# EAGLE design ROM24k_final_rev01 (EAGLE 9.6.2)
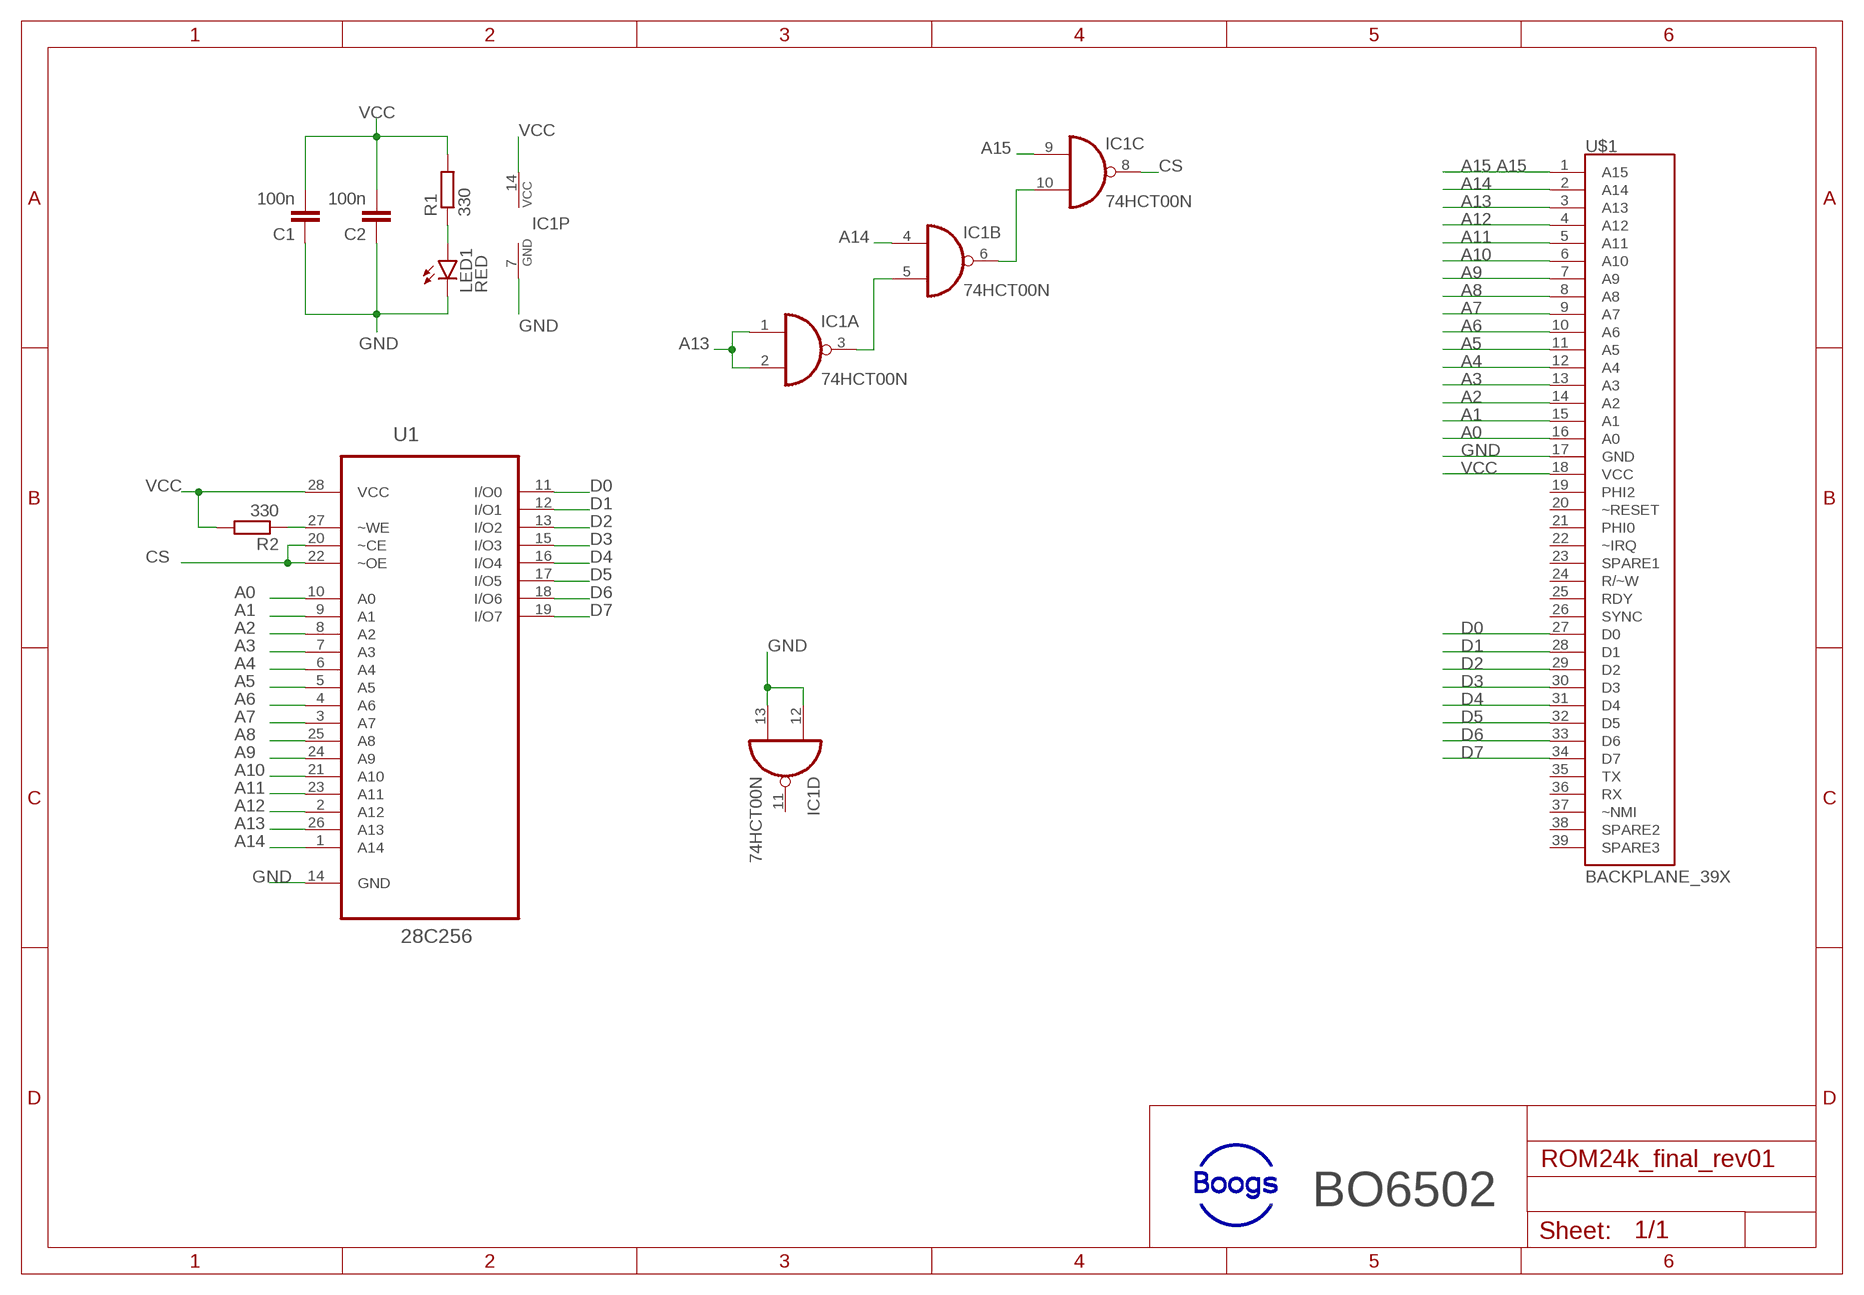
[diagram p0: schematic, sheet 1]

## Parts
C1  100n  C-EU025-025X050  [C025-025X050]
C2  100n  C-EU025-025X050  [C025-025X050]
IC1  74HCT00N  [DIL14]
LED1  RED  LED5MM  [LED5MM]
R1  330  R-EU_0207/10  [0207/10]
R2  330  R-EU_0207/10  [0207/10]
U1  28C256  AT28C256-15PU  [DIP254P1524X482-28]
U$1  BACKPLANE_39X  [BP_39X]

## Nets
A0: U1.10(A0) U$1.16(A0)
A1: U1.9(A1) U$1.15(A1)
A2: U1.8(A2) U$1.14(A2)
A3: U1.7(A3) U$1.13(A3)
A4: U1.6(A4) U$1.12(A4)
A5: U1.5(A5) U$1.11(A5)
A6: U1.4(A6) U$1.10(A6)
A7: U1.3(A7) U$1.9(A7)
A8: U1.25(A8) U$1.8(A8)
A9: U1.24(A9) U$1.7(A9)
A10: U1.21(A10) U$1.6(A10)
A11: U1.23(A11) U$1.5(A11)
A12: U1.2(A12) U$1.4(A12)
A13: IC1.1(A:I0) IC1.2(A:I1) U1.26(A13) U$1.3(A13)
A14: IC1.4(B:I0) U1.1(A14) U$1.2(A14)
A15: IC1.9(C:I0) U$1.1(A15)
CS: IC1.8(C:O) U1.20(~CE) U1.22(~OE)
D0: U1.11(I/O0) U$1.27(D0)
D1: U1.12(I/O1) U$1.28(D1)
D2: U1.13(I/O2) U$1.29(D2)
D3: U1.15(I/O3) U$1.30(D3)
D4: U1.16(I/O4) U$1.31(D4)
D5: U1.17(I/O5) U$1.32(D5)
D6: U1.18(I/O6) U$1.33(D6)
D7: U1.19(I/O7) U$1.34(D7)
GND: C1.1 C2.1 IC1.7(P:GND) IC1.12(D:I0) IC1.13(D:I1) LED1.K(C) U1.14(GND) U$1.17(GND)
N$1: R2.1 U1.27(~WE)
N$3: IC1.3(A:O) IC1.5(B:I1)
N$5: IC1.6(B:O) IC1.10(C:I1)
N$6: LED1.A R1.1
VCC: C1.2 C2.2 IC1.14(P:VCC) R1.2 R2.2 U1.28(VCC) U$1.18(VCC)
Unconnected: IC1.11(D:O) U$1.19(PHI2) U$1.20(~RESET) U$1.21(PHI0) U$1.22(~IRQ) U$1.23(SPARE1) U$1.24(R/~W) U$1.25(RDY) U$1.26(SYNC) U$1.35(TX) U$1.36(RX) U$1.37(~NMI) U$1.38(SPARE2) U$1.39(SPARE3)

## Notes on the sheet
- BO6502

## Library data of the parts
C1 C2 = rcl:C-EU: CAPACITOR, European symbol; SPICEPREFIX: C
IC1 = 74xx-eu:74*00: Quad 2-input NAND gate
LED1 = led:LED: LED OSRAM: - CHIPLED LG R971, LG N971, LY N971, LG Q971, LY Q971, LO R971, LY R971 LH N974, LH R974 LS Q976, LO Q976, LY Q976 LO Q996 - Hyper CHIPLED LW Q18S LB Q993, LB Q99A, LB R99A - SideLED LS A670, LO A670, LY A670, LG A670, LP A670 LB A673, LV A673, LT A673, LW A673 LH A674 LY A675 LS A676, LA A676, LO A676, LY A676, LW A676 LS A679, LY A679, LG A679 - Hyper Micro SIDELED® LS Y876, LA Y876, LO Y876, LY Y876 LT Y87S - SmartLED LW L88C, LW L88S LB L89C, LB L89S, LG L890 LS L89K, LO L89K, LY L89K LS L896, LA L896, LO L896, LY L896 - TOPLED LS T670, LO T670, LY T670, LG T670, LP T670 LSG T670, LSP T670, LSY T670, LOP T670, LYG T670 LG T671, LOG T671, LSG T671 LB T673, LV T673, LT T673, LW T673 LH T674 LS T676, LA T676, LO T676, LY T676, LB T676, LH T676, LSB T676, LW T676 LB T67C, LV T67C, LT T67C, LS T67K, LO T67K, LY T67K, LW E67C LS E67B, LA E67B, LO E67B, LY E67B, LB E67C, LV E67C, LT E67C LW T67C LS T679, LY T679, LG T679 LS T770, LO T770, LY T770, LG T770, LP T770 LB T773, LV T773, LT T773, LW T773 LH T774 LS E675, LA E675, LY E675, LS T675 LS T776, LA T776, LO T776, LY T776, LB T776 LHGB T686 LT T68C, LB T68C - Hyper Mini TOPLED® LB M676 - Mini TOPLED Santana® LG M470 LS M47K, LO M47K, LY M47K Source: http://www.osram.convergy.de LUXEON: - LUMILED® LXK2-PW12-R00, LXK2-PW12-S00, LXK2-PW14-U00, LXK2-PW14-V00 LXK2-PM12-R00, LXK2-PM12-S00, LXK2-PM14-U00 LXK2-PE12-Q00, LXK2-PE12-R00, LXK2-PE12-S00, LXK2-PE14-T00, LXK2-PE14-U00 LXK2-PB12-K00, LXK2-PB12-L00, LXK2-PB12-M00, LXK2-PB14-N00, LXK2-PB14-P00, LXK2-PB14-Q00 LXK2-PR12-L00, LXK2-PR12-M00, LXK2-PR14-Q00, LXK2-PR14-R00 LXK2-PD12-Q00, LXK2-PD12-R00, LXK2-PD12-S00 LXK2-PH12-R00, LXK2-PH12-S00 LXK2-PL12-P00, LXK2-PL12-Q00, LXK2-PL12-R00 Source: www.luxeon.com KINGBRIGHT: KA-3528ASYC Source: www.kingbright.com
R1 R2 = rcl:R-EU_: RESISTOR, European symbol; SPICEPREFIX: R
U1 = AT28C256-15PU:AT28C256-15PU: Paged Parallel EEPROM Check availability <https://pricing.snapeda.com/parts/AT28C256-15PU/Microchip/view-part?ref=eda>; AVAILABILITY: In Stock; CHECK_PRICES: https://www.snapeda.com/parts/AT28C256-15PU/Microchip/view-part/?ref=eda; DESCRIPTION: EEPROM Memory IC 256Kb (32K x 8) Parallel 150 ns 28-PDIP; MF: Microchip; MP: AT28C256-15PU; PACKAGE: DIP-28 Microchip; PRICE: None; PURCHASE-URL: https://www.snapeda.com/api/url_track_click_mouser/?unipart_id=1769426&manufacturer=Microchip&part_name=AT28C256-15PU&search_term=None; SNAPEDA_LINK: https://www.snapeda.com/parts/AT28C256-15PU/Microchip/view-part/?ref=snap
U$1 = 65xx_family:BACKPLANE_39X; A15: A15

## Board
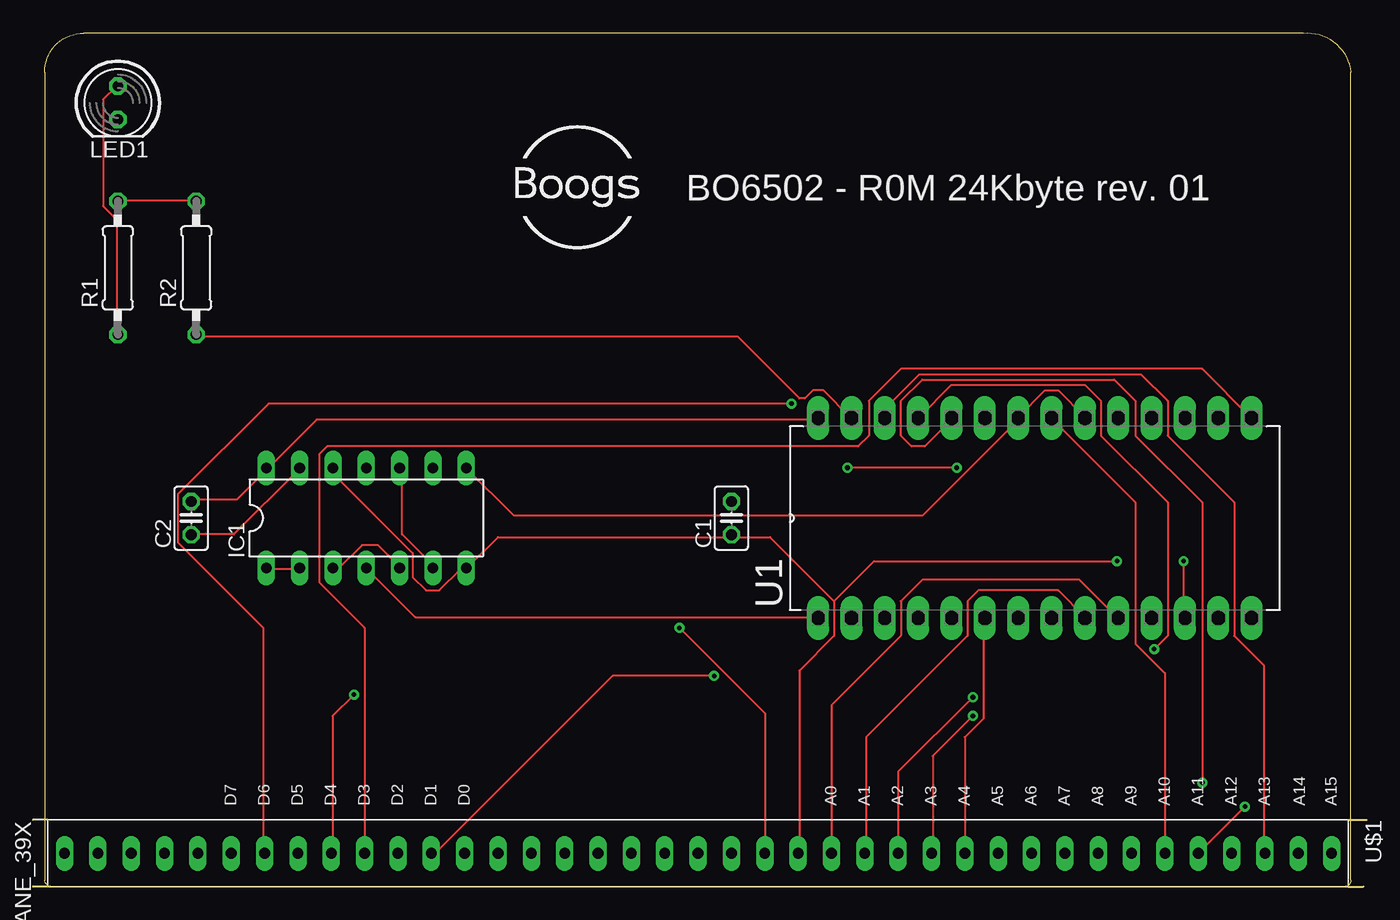
[diagram p1: board, top side]
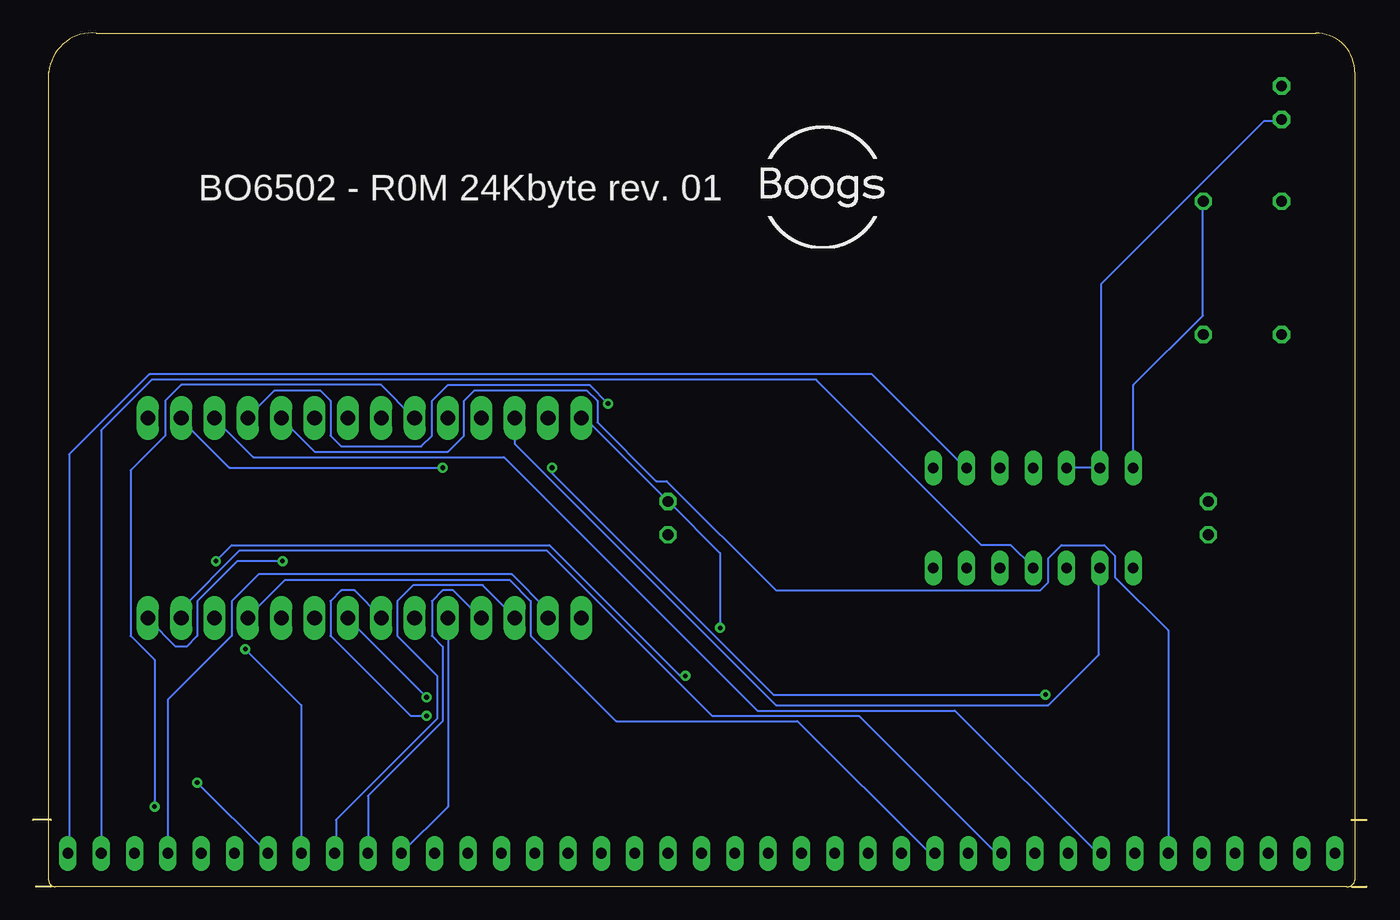
[diagram p2: board, bottom side, seen from below]

Size 101.6 x 65.02 mm. Coordinates in mm from the lower left corner, seen from the top.
Outline: 1.14,5.08 0,5.08
Outline: 1.14,0 0,0
Outline: 100.2,5.08 101.6,5.08
Outline: 100.2,0 101.35,0
Outline: 1.52,0 99.89,0 arc90 100.39,0.5 100.39,62 arc90 96.75,65 3.89,65 arc90 0.89,62 0.89,0.5 arc90 1.52,0
Copper layers (1*16): Top 0.035mm / dielectric 1.5mm / Bottom 0.035mm
Design rules "default *": minimum track width 6mil, minimum drill 0.35mm, track to track 10mil, track to pad 10mil, pad to pad 10mil, via to via 10mil, smd to smd 6mil, copper to edge 40mil, drill to drill 6mil, minimum pad ring 10mil, minimum via ring 8mil, stop-mask expansion 4mil, vias tented up to drill 15mil, thermal gap 10mil

### Footprints (pad centres in the part's own frame; a part is rotated, then mirrored left to right if it is on the bottom)
C025-025X050 = drill 0.813 octagon: 1 -1.27,0; 2 1.27,0
DIL14 = drill 0.813 long: 1 -7.62,-3.81; 2 -5.08,-3.81; 3 -2.54,-3.81; 4 0,-3.81; 5 2.54,-3.81; 6 5.08,-3.81; 7 7.62,-3.81; 8 7.62,3.81; 9 5.08,3.81; 10 2.54,3.81; 11 0,3.81; 12 -2.54,3.81; 13 -5.08,3.81; 14 -7.62,3.81
LED5MM = drill 0.813 octagon: A -1.27,0; K 1.27,0
0207/10 = drill 0.813 octagon: 1 -5.08,0; 2 5.08,0
DIP254P1524X482-28 = drill 1.118 long: 1 -15.24,33.02; 2 -15.24,30.48; 3 -15.24,27.94; 4 -15.24,25.4; 5 -15.24,22.86; 6 -15.24,20.32; 7 -15.24,17.78; 8 -15.24,15.24; 9 -15.24,12.7; 10 -15.24,10.16; 11 -15.24,7.62; 12 -15.24,5.08; 13 -15.24,2.54; 14 -15.24,0; 15 0,0; 16 0,2.54; 17 0,5.08; 18 0,7.62; 19 0,10.16; 20 0,12.7; 21 0,15.24; 22 0,17.78; 23 0,20.32; 24 0,22.86; 25 0,25.4; 26 0,27.94; 27 0,30.48; 28 0,33.02
BP_39X = drill 0.813 long: 1 1.27,59.69; 2 1.27,57.15; 3 1.27,54.61; 4 1.27,52.07; 5 1.27,49.53; 6 1.27,46.99; 7 1.27,44.45; 8 1.27,41.91; 9 1.27,39.37; 10 1.27,36.83; 11 1.27,34.29; 12 1.27,31.75; 13 1.27,29.21; 14 1.27,26.67; 15 1.27,24.13; 16 1.27,21.59; 17 1.27,19.05; 18 1.27,16.51; 19 1.27,13.97; 20 1.27,11.43; 21 1.27,8.89; 22 1.27,6.35; 23 1.27,3.81; 24 1.27,1.27; 25 1.27,-1.27; 26 1.27,-3.81; 27 1.27,-6.35; 28 1.27,-8.89; 29 1.27,-11.43; 30 1.27,-13.97; 31 1.27,-16.51; 32 1.27,-19.05; 33 1.27,-21.59; 34 1.27,-24.13; 35 1.27,-26.67; 36 1.27,-29.21; 37 1.27,-31.75; 38 1.27,-34.29; 39 1.27,-36.83

### Placement (x,y rotation side)
C1  53.21,28.07 90 top
C2  12.06,28.07 90 top
IC1  25.4,28.07 0 top
LED1  6.48,59.69 270 top
R1  6.48,47.12 90 top
R2  12.45,47.12 90 top
U1  92.84,35.69 90 top
U$1  39.24,3.81 270 top

### Tracks (layer width: path | path; a pad name or v marks a point on that pad's centre or on a via)
A0
  Top 0.152: U$1.16 60.83,13.82 66.12,19.1 66.12,21.75 67.74,23.37 79.73,23.37 82.58,20.53 U1.10
A1
  Top 0.152: U$1.15 63.48,2.65 63.48,11.38 71.2,19.1 71.2,21.75 72.01,22.56 78.1,22.56 80.14,20.53 U1.9
A2  (via drill 0.35)
  Top 0.152: U$1.14 65.91,8.74 v71.6,14.43
  Bottom 0.152: v71.6,14.43 77.49,20.32 U1.8
A3  (via drill 0.35)
  Top 0.152: v71.6,13.01 68.55,9.96 68.55,2.65 U$1.13
  Bottom 0.152: v71.6,13.01 72.82,13.01 78.92,19.1 78.92,21.75 78.1,22.56 77.09,22.56 75.06,20.53 U1.7
A4
  Top 0.152: U$1.12 70.99,11.38 72.41,12.81 72.41,20.32 U1.6
A5
  Bottom 0.152: U$1.11 69.98,6.1 U1.5
A6
  Bottom 0.152: U$1.10 76.07,6.91 70.38,12.6 70.38,18.29 71.2,19.1 71.2,21.75 70.38,22.56 69.57,22.56 67.54,20.53 U1.4
A7
  Bottom 0.152: U$1.9 78.51,2.65 78.51,5.08 70.79,12.81 70.79,16.06 73.84,19.1 73.84,21.75 72.62,22.97 67.33,22.97 64.9,20.53 U1.3
A8  (via drill 0.35)
  Top 0.152: v85.42,18.09 86.44,19.1 86.44,29.26 81.36,34.34 81.36,36.99 80.14,38.21 69.98,38.21 67.54,35.77 U1.25
  Bottom 0.152: U$1.8 81.15,13.82 v85.42,18.09
A9  (via drill 0.35)
  Top 0.152: v89.08,7.93 89.08,29.26 84,34.34 84,36.99 82.37,38.61 67.74,38.61 66.12,36.99 66.12,34.34 66.93,33.53 67.94,33.53 69.98,35.56 U1.24
  Bottom 0.152: v89.08,7.93 U$1.7
A10
  Top 0.152: U$1.6 86.23,16.26 84,18.49 84,29.26 77.7,35.56 U1.21
A11  (via drill 0.35)
  Top 0.152: v92.33,6.1 U$1.5
  Bottom 0.152: v92.33,6.1 92.33,17.28 94.16,19.1 94.16,31.7 91.52,34.34 91.52,36.99 90.3,38.21 75.06,38.21 72.62,35.77 U1.23
A12
  Bottom 0.152: U$1.4 91.31,14.23 86.44,19.1 86.44,21.75 84.4,23.78 65.1,23.78 62.46,21.14 62.46,20.53 U1.2
A13
  Top 0.152: IC1.1 17.96,24.18 20.19,24.18 IC1.2 | U1.26 64.9,36.38 67.54,39.02 84.4,39.02 86.44,36.99 86.44,34.34 91.52,29.26 91.52,19.1 93.75,16.87 93.75,2.65 U$1.3
  Bottom 0.152: U1.26 64.9,33.73 44.98,13.82 24.26,13.82 20.4,17.68 20.4,24.18 IC1.2
A14
  Top 0.152: IC1.4 29.13,20.53 59.82,20.53 U1.1
  Bottom 0.152: U$1.2 96.39,34.75 92.53,38.61 41.94,38.61 29.34,26.01 27.1,26.01 25.48,24.39 IC1.4
A15
  Bottom 0.152: U$1.1 98.83,2.65 98.83,32.92 92.73,39.02 37.67,39.02 30.56,31.91 IC1.9
CS
  Top 0.152: IC1.8 36.65,28.25 67.74,28.25 75.06,35.56 U1.22 75.06,35.77 77.09,37.8 78.1,37.8 80.14,35.77 U1.20
D0
  Bottom 0.152: U$1.27 33,2.65 33.4,2.65 43.36,12.6 57.18,12.6 63.68,19.1 63.68,21.75 65.3,23.37 82.37,23.37 85.22,20.53 U1.11
D1  (via drill 0.35)
  Top 0.152: v51.89,16.06 44.17,16.06 30.76,2.65 30.35,2.65 U$1.28 | v87.66,24.79 87.66,20.53 U1.12
  Bottom 0.152: v51.89,16.06 52.3,16.06 62.26,26.01 86.44,26.01 v87.66,24.79
D2
  Bottom 0.152: U1.13 90.3,21.14 85.83,25.61 62.46,25.61 49.86,13.01 38.68,13.01 28.32,2.65 27.91,2.65 U$1.29
D3
  Top 0.152: U$1.30 25.27,19.71 21.82,23.17 21.82,32.92 22.43,33.53 62.87,33.53 63.68,34.34 63.68,36.99 66.12,39.42 89.08,39.42 92.73,35.77 U1.15
D4  (via drill 0.35)
  Top 0.152: v24.46,14.63 22.84,13.01 22.84,2.65 U$1.31 | v70.38,31.91 v62.05,31.91
  Bottom 0.152: v24.46,14.63 45.19,14.63 62.05,31.5 v62.05,31.91 | v70.38,31.91 86.64,31.91 90.3,35.56 U1.16
D5
  Bottom 0.152: U$1.32 20.19,2.65 20.6,2.65 31.37,13.41 46.41,13.41 65.71,32.72 84.81,32.72 87.66,35.56 U1.17
D6  (via drill 0.35)
  Top 0.152: v57.79,36.78 17.96,36.78 11.05,29.87 11.05,26.22 17.55,19.71 17.55,2.65 U$1.33
  Bottom 0.152: v57.79,36.78 59.21,38.21 69.98,38.21 71.2,36.99 71.2,34.34 72.01,33.53 78.1,33.53 78.92,34.34 78.92,36.99 79.73,37.8 83.19,37.8 85.22,35.77 U1.18
D7
  Bottom 0.152: U$1.34 15.11,19.51 19.18,23.57 19.18,25.2 19.99,26.01 23.24,26.01 24.26,25 24.26,23.17 24.87,22.56 44.98,22.56 53.32,30.89 54.13,30.89 58.6,35.36 58.6,36.99 59.41,37.8 67.94,37.8 68.76,36.99 68.76,34.34 69.98,33.13 80.14,33.13 82.58,35.56 U1.19
GND  (via drill 0.35)
  Top 0.152: C2.1 12.06,26.83 15.32,26.83 20.19,31.7 IC1.13 | IC1.12 23.04,31.7 23.04,31.3 28.93,25.4 28.93,23.57 29.95,22.56 30.96,22.56 32.59,24.18 33,24.18 IC1.7 33.2,24.39 35.43,26.62 53.11,26.62 C1.1 53.32,26.62 56.16,26.62 61.04,21.75 | 61.04,21.75 61.04,19.1 58.4,16.46 58.4,2.65 U$1.17 | v82.58,24.79 64.08,24.79 61.04,21.75
  Bottom 0.152: IC1.12 22.84,31.91 20.4,31.91 IC1.13 20.19,31.91 20.19,45.93 7.8,58.32 6.58,58.32 LED1.K | v82.58,24.79 86.03,24.79 89.08,21.75 89.08,19.1 89.89,18.29 90.7,18.29 92.73,20.32 U1.14
N$1
  Top 0.152: R2.1 12.47,41.86 53.72,41.86 58.4,37.19 58.8,37.19 59.41,37.8 60.22,37.8 62.26,35.77 U1.27
N$3
  Top 0.152: IC1.3 23.04,24.39 23.44,24.39 25.07,26.01 26.29,26.01 27.91,24.39 IC1.5
N$5
  Top 0.152: IC1.10 28.12,31.7 28.12,26.83 30.56,24.39 IC1.6
N$6
  Top 0.152: R1.1 6.38,42.07 6.38,50.8 5.36,51.82 5.36,59.95 6.38,60.96 LED1.A
VCC  (via drill 0.35)
  Top 0.152: R1.2 6.58,52.23 12.27,52.23 R2.2 | C2.2 12.06,29.47 15.52,29.47 17.75,31.7 IC1.14 17.96,31.91 21.61,35.56 59.82,35.56 U1.28 | U$1.18 55.75,13.21 v49.25,19.71
  Bottom 0.152: R2.2 12.47,52.02 12.47,43.49 17.75,38.21 17.75,31.91 IC1.14 | v49.25,19.71 49.25,25.4 53.11,29.26 C1.2 53.32,29.47 59.41,35.56 59.82,35.56 U1.28

### Text on the board
tNames: BO6502 - R0M 24Kbyte rev. 01 | D7 | D6 | D5 | D4 | D3 | D2 | D1 | D0 | A0 | A1 | A2 | A3 | A4 | A5 | A6 | A7 | A8 | A9 | A10 | A11 | A12 | A13 | A14 | A15
bNames: BO6502 - R0M 24Kbyte rev. 01